# EAGLE schematic yamato (EAGLE 6.5.0)
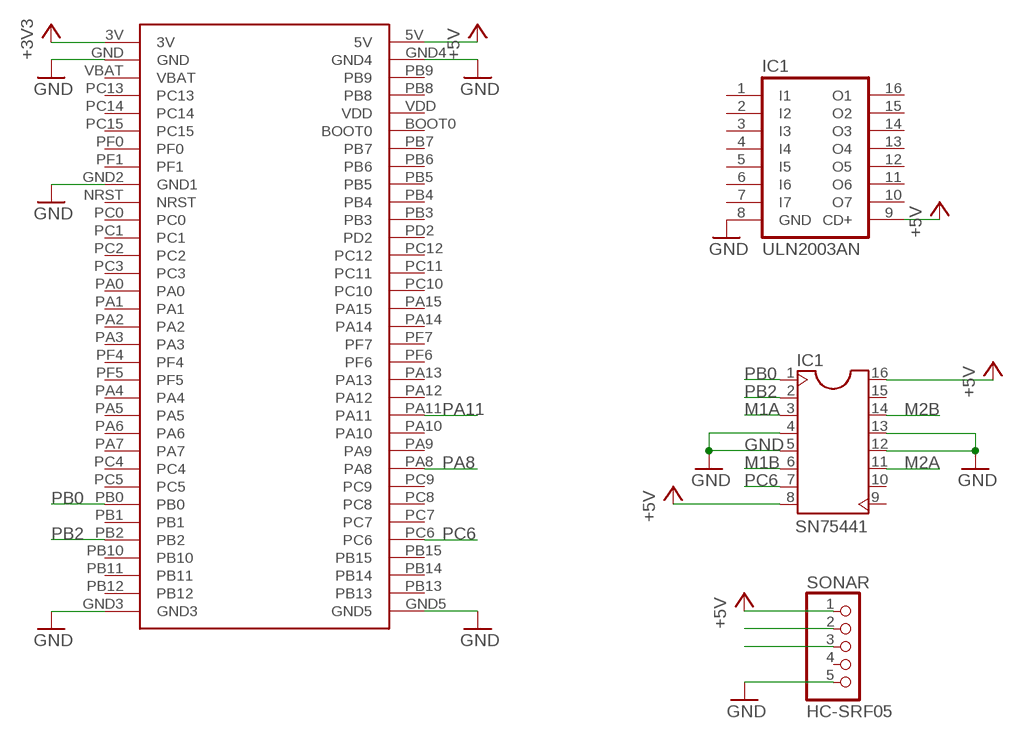
[diagram p0: schematic, sheet 1]

## Parts
IC1  ULN2003AN  [DIL16]
SONAR  HC-SRF05  PINHD-1X5  [1X05]
U$1  STM32F0DISCOVERY-DEVICE  [STM32F0DISCOVERY-PACKAGE]
U$2  SN75441-DEVICESN75411-SOCKET  [SOCKET-16]

## Nets
+3V3: U$1.3V
+5V: IC1.9(CD+) SONAR.1 U$1.5V U$2.8(VCC2) U$2.16(VCC1)
GND: IC1.8(GND) SONAR.5 U$1.GND U$1.GND2(GND1) U$1.GND3 U$1.GND4 U$1.GND5 U$2.4(GND) U$2.5(GND1) U$2.12(GND2) U$2.13(GND3)
M1A: U$2.3(1Y)
M1B: U$2.6(2Y)
M2A: U$2.11(3Y)
M2B: U$2.14(4Y)
PA8: SONAR.3 U$1.PA8
PA11: SONAR.2 U$1.PA11
PB0: U$1.PB0 U$2.1(12EN)
PB2: U$1.PB2 U$2.2(1A)
PC6: U$1.PC6 U$2.7(2A)
Unconnected: IC1.1(I1) IC1.2(I2) IC1.3(I3) IC1.4(I4) IC1.5(I5) IC1.6(I6) IC1.7(I7) IC1.10(O7) IC1.11(O6) IC1.12(O5) IC1.13(O4) IC1.14(O3) IC1.15(O2) IC1.16(O1) SONAR.4 U$1.BOOT0 U$1.NRST U$1.PA0 U$1.PA1 U$1.PA2 U$1.PA3 U$1.PA4 U$1.PA5 U$1.PA6 U$1.PA7 U$1.PA9 U$1.PA10 U$1.PA12 U$1.PA13 U$1.PA14 U$1.PA15 U$1.PB1 U$1.PB3 U$1.PB4 U$1.PB5 U$1.PB6 U$1.PB7 U$1.PB8 U$1.PB9 U$1.PB10 U$1.PB11 U$1.PB12 U$1.PB13 U$1.PB14 U$1.PB15 U$1.PC0 U$1.PC1 U$1.PC2 U$1.PC3 U$1.PC4 U$1.PC5 U$1.PC7 U$1.PC8 U$1.PC9 U$1.PC10 U$1.PC11 U$1.PC12 U$1.PC13 U$1.PC14 U$1.PC15 U$1.PD2 U$1.PF0 U$1.PF1 U$1.PF4 U$1.PF5 U$1.PF6 U$1.PF7 U$1.VBAT U$1.VDD U$2.9(34EN) U$2.10(3A) U$2.15(4A)

## Library data of the parts
IC1 = uln-udn:ULN2003A: DRIVER ARRAY
SONAR = pinhead:PINHD-1X5: PIN HEADER
U$1 = stm32f0discovery:STM32F0DISCOVERY-DEVICE
U$2 = yamato:SN75441-DEVICE